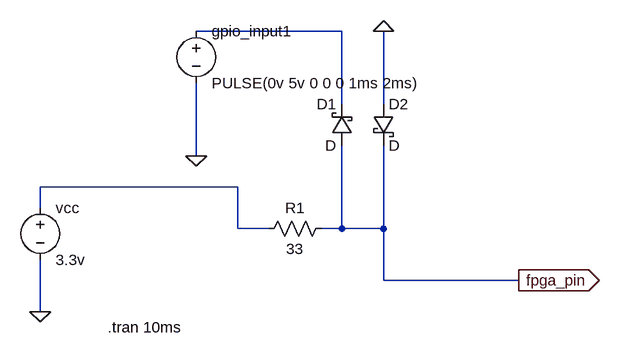
[diagram p0: schematic de0-cv-gpio-test.asc]
de0-cv-gpio-test.asc, the LTspice schematic file:
Version 4
SHEET 1 880 680
WIRE 112 -128 -112 -128
WIRE 112 -16 112 -128
WIRE 176 -16 176 -128
WIRE -112 64 -112 -48
WIRE -48 112 -352 112
WIRE -352 144 -352 112
WIRE -48 176 -48 112
WIRE 0 176 -48 176
WIRE 112 176 112 48
WIRE 112 176 80 176
WIRE 176 176 176 48
WIRE 176 176 112 176
WIRE 176 256 176 176
WIRE 384 256 176 256
WIRE -352 304 -352 224
FLAG -352 304 0
FLAG 384 256 fpga_pin
IOPIN 384 256 Out
FLAG 176 -128 0
FLAG -112 64 0
SYMBOL voltage -352 128 R0
WINDOW 123 0 0 Left 2
WINDOW 39 0 0 Left 2
SYMATTR InstName vcc
SYMATTR Value 3.3v
SYMBOL res 96 160 R90
WINDOW 0 0 56 VBottom 2
WINDOW 3 32 56 VTop 2
SYMATTR InstName R1
SYMATTR Value 33
SYMBOL voltage -112 -144 R0
WINDOW 123 0 0 Left 2
WINDOW 39 0 0 Left 2
SYMATTR InstName gpio_input1
SYMATTR Value PULSE(0v 5v 0 0 0 1ms 2ms)
SYMBOL schottky 128 48 R180
WINDOW 0 24 64 Left 2
WINDOW 3 24 0 Left 2
SYMATTR InstName D1
SYMBOL schottky 160 -16 R0
SYMATTR InstName D2
TEXT -248 328 Left 2 !.tran 10ms

The netlist it stands for:
* de0-cv-gpio-test.asc
vcc N002 0 3.3v
R1 fpga_pin N002 33
V§gpio_input1 N001 0 PULSE(0v 5v 0 0 0 1ms 2ms)
D1 fpga_pin N001 D
D2 0 fpga_pin D
.model D D
.lib standard.dio
.tran 10ms
.backanno
.end